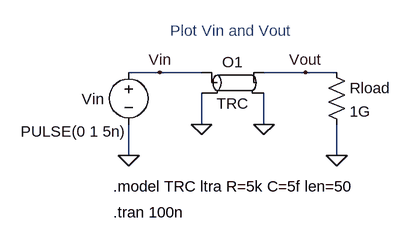
[diagram p0: schematic Fig2_23.asc]
Fig2_23.asc, the LTspice schematic file:
Version 4
SHEET 1 1056 688
WIRE -160 336 -160 288
WIRE -112 208 -160 208
WIRE -48 208 -112 208
WIRE -48 288 -48 240
WIRE 48 288 48 240
WIRE 112 208 48 208
WIRE 160 208 112 208
WIRE 160 336 160 288
FLAG -160 336 0
FLAG -48 288 0
FLAG 48 288 0
FLAG 160 336 0
FLAG -112 208 Vin
FLAG 112 208 Vout
SYMBOL ltline 0 224 R0
SYMATTR InstName O1
SYMATTR Value TRC
SYMBOL voltage -160 192 R0
WINDOW 0 -72 57 Left 0
WINDOW 3 -166 107 Left 0
WINDOW 123 0 0 Left 0
WINDOW 39 0 0 Left 0
SYMATTR InstName Vin
SYMATTR Value PULSE(0 1 5n)
SYMBOL res 144 192 R0
SYMATTR InstName Rload
SYMATTR Value 1G
TEXT -184 384 Left 0 !.model TRC ltra R=5k C=5f len=50
TEXT -184 424 Left 0 !.tran 100n
TEXT -96 144 Left 0 ;Plot Vin and Vout

The netlist it stands for:
* Fig2_23.asc
O1 Vin 0 Vout 0 TRC
Vin Vin 0 PULSE(0 1 5n)
Rload Vout 0 1G
.model TRC ltra R=5k C=5f len=50
.tran 100n
* Plot Vin and Vout
.backanno
.end